# EAGLE design EEZ tester r1B2 (EAGLE 6.1)
Assembly variants: Farnell, TME

## Sheet 1 of 2: Power board tester
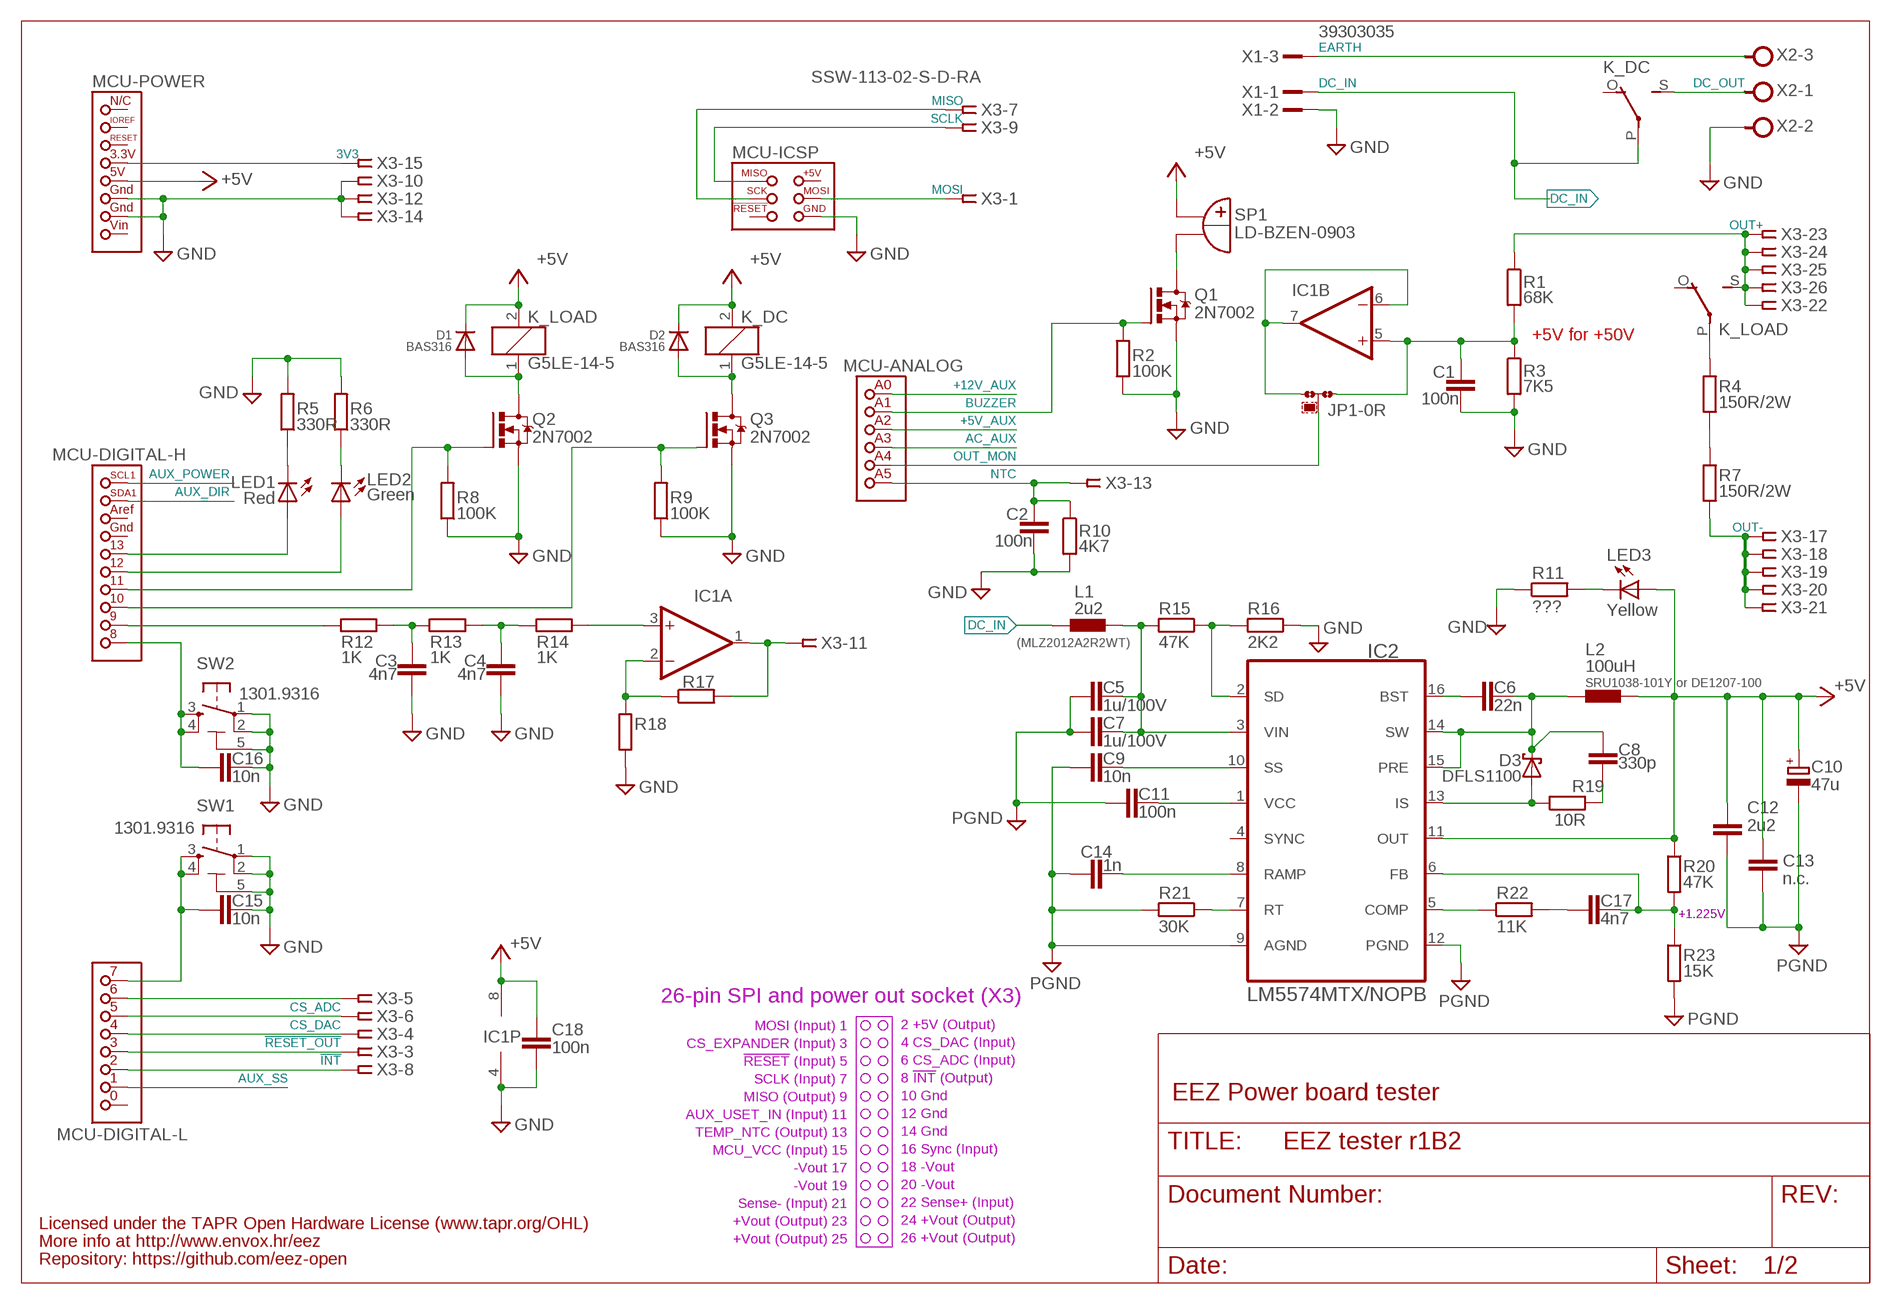
[diagram p0: schematic, sheet 1]

### Parts
C1  100n  C-EUC0603  [C0603]
C2  100n  C-EUC0603  [C0603]
C3  4n7  C-EUC0805  [C0805]
C4  4n7  C-EUC0805  [C0805]
C5  1u/100V  C-EUC1206  [C1206]
C6  22n  C-EUC0805  [C0805]
C7  1u/100V  C-EUC1206  [C1206]
C8  330p  C-EUC0805  [C0805]
C9  10n  C-EUC0805  [C0805]
C10  47u  ECAPPANASONIC_H  [CAPAE660X610N]
C11  100n  C-EUC0603  [C0603]
C12  2u2  C-EUC0805  [C0805]  (variant Farnell: 2320829)  (variant TME: CL21B225KAFNNNG )
C13  n.c.  C-EUC0805  [C0805]  (variant Farnell: 2320829)  (variant TME: CL21B225KAFNNNG )
C14  1n  C-EUC0805  [C0805]
C15  10n  C-EUC0805  [C0805]
C16  10n  C-EUC0805  [C0805]
C17  4n7  C-EUC0805  [C0805]
C18  100n  C-EUC0603  [C0603]
D1  BAS316  DIODE-SOD323-W  [SOD323-W]
D2  BAS316  DIODE-SOD323-W  [SOD323-W]
D3  DFLS1100  SCHOTTKYSOD123  [SOD123]
IC1  TL072SOIC8  [SOIC127P600X173-8N]
IC2  LM5574MTX/NOPB  LM5574  [SOP65P640X110-16N]
JP1  0R-JUMPA  [A0R-JMP]
K_DC  G5LE-14-5  G5LE  [G5LE]
K_LOAD  G5LE-14-5  G5LE  [G5LE]
L1  2u2  L-EU0805  [0805]
L2  100uH  COILCRAFT_MSS1278  [MSS1278]
LED1  Red  LED3MM  [LED3MM]
LED2  Green  LED3MM  [LED3MM]
LED3  Yellow  LED3MM  [LED3MM]
MCU  ARDUINO_LEONARDO  [ARDUINO_LEONARDO]
Q1  2N7002  [SOT103P240X110-3N]
Q2  2N7002  [SOT103P240X110-3N]
Q3  2N7002  [SOT103P240X110-3N]
R1  68K  R-EU_R0805  [R0805]
R2  100K  R-EU_R0805  [R0805]
R3  7K5  R-EU_R0805  [R0805]
R4  150R/2W  R-EU_0617/22  [0617/22]
R5  330R  R-EU_R0805  [R0805]
R6  330R  R-EU_R0805  [R0805]
R7  150R/2W  R-EU_0617/22  [0617/22]
R8  100K  R-EU_R0805  [R0805]
R9  100K  R-EU_R0805  [R0805]
R10  4K7  R-EU_R0805  [R0805]
R11  ???  R-EU_R0805  [R0805]
R12  1K  R-EU_R0805  [R0805]
R13  1K  R-EU_R0805  [R0805]
R14  1K  R-EU_R0805  [R0805]
R15  47K  R-EU_R0805  [R0805]
R16  2K2  R-EU_R0805  [R0805]
R17  R-EU_R0805  [R0805]
R18  R-EU_R0805  [R0805]
R19  10R  R-EU_R1206  [R1206]
R20  47K  R-EU_R0805  [R0805]
R21  30K  R-EU_R0805  [R0805]
R22  11K  R-EU_R0805  [R0805]
R23  15K  R-EU_R0805  [R0805]
SP1  LD-BZEN-0903  BUZZER-2  [LD-BZEN-0903]
SW1  1301.9316  TACT_SW  [TACTM-6XN]
SW2  1301.9316  TACT_SW  [TACTM-6XN]
X1  39303035  MINIFIT-3PIN  [MINIFIT_6659-3]
X2  TBLOCK5.0_3A  [TBLOCK5.0_3]
X3  SSW-113-02-S-D-RA  [TSW-113-02-S-D-RA]

### Nets
3V3: MCU.3.3V(-POWER:3V3) X3.15
!INT: MCU.2(-DIGITAL-L:2(PE4)) X3.8
!RESET_OUT: MCU.3(-DIGITAL-L:3(PE5)) X3.3
+5V: C10.1(+) C12.1 C13.1 C18.1 D1.C D2.C IC1.8(P:V+) IC2.11(OUT) K_DC.2 K_LOAD.2 L2.2 LED3.A MCU.5V(-POWER:5V) R20.1 SP1.+B(+) ; also sheet 2
+5V_AUX: MCU.A2(-ANALOG:ADC2) ; also sheet 2
+12V_AUX: MCU.A0(-ANALOG:ADC0) ; also sheet 2
AC_AUX: MCU.A3(-ANALOG:ADC3) ; also sheet 2
AUX_DIR: MCU.SDA1(-DIGITAL-H:SDA1) ; also sheet 2
AUX_POWER: MCU.SCL1(-DIGITAL-H:SCL1) ; also sheet 2
AUX_SS: MCU.1(-DIGITAL-L:1(PE1)) ; also sheet 2
AUX_USET: IC1.1(A:OUT) R17.2 X3.11
BUZZER: MCU.A1(-ANALOG:ADC1) Q1.1(G) R2.2
CS_ADC: MCU.5(-DIGITAL-L:5(PE3)) X3.6
CS_DAC: MCU.4(-DIGITAL-L:4(PG5)) X3.4
CS_EXPANDER: MCU.6(-DIGITAL-L:6(PH3)) X3.5
DC_IN: K_DC.P(2:P) L1.1 X1.1
DC_OUT: K_DC.S(2:S) X2.1
DC_PREG1: C5.1 C7.1 IC2.3(VIN) L1.2 R15.2
EARTH: X1.3 X2.3
GND [gnd]: C1.1 C2.1 C3.2 C4.2 C5.2 C7.2 C9.2 C10.2(-) C11.1 C12.2 C13.2 C14.1 C15.2 C16.2 C18.2 IC1.4(P:V-) IC2.9(AGND) IC2.12(PGND) MCU.GND1(-POWER:GND1) MCU.GND2(-POWER:GND2) MCU.ICSP_GND(-ICSP:GND) Q1.2(S) Q2.2(S) Q3.2(S) R2.1 R3.2 R5.2 R6.2 R8.1 R9.1 R10.2 R11.1 R16.1 R18.2 R21.2 R23.2 SW1.1 SW1.2 SW1.5(5-GND) SW2.1 SW2.2 SW2.5(5-GND) X1.2 X2.2 X3.10 X3.12 X3.14 ; supply symbol labelled PGND ; also sheet 2
IS: D3.A IC2.13(IS) R19.1
MISO: MCU.ICSP_SCK(-ICSP:SCK) X3.7
MOSI: MCU.ICSP_MOSI(-ICSP:MOSI) X3.1
N$1: R4.1 R7.2
N$2: K_LOAD.P(2:P) R4.2
N$3: LED3.K(C) R11.2
N$5: IC1.6(B:-IN) IC1.7(B:OUT) JP1.3
N$6: MCU.9(-DIGITAL-H:9(PH6)) R12.2
N$7: C1.2 IC1.5(B:+IN) JP1.1 R1.2 R3.1
N$8: MCU.11 Q2.1(G) R8.2
N$9: C4.1 R13.1 R14.2
N$10: Q1.3(D) SP1.-B(-)
N$11: C15.1 MCU.7(-DIGITAL-L:7(PH4)) SW1.3 SW1.4
N$12: LED2.A MCU.12
N$13: C3.1 R12.1 R13.2
N$14: LED1.A MCU.13
N$15: LED1.K(C) R5.1
N$16: LED2.K(C) R6.1
N$17: C16.1 MCU.8(-DIGITAL-H:8(PH5)) SW2.3 SW2.4
N$18: MCU.10 Q3.1(G) R9.2
N$20: D2.A K_DC.1 Q3.3(D)
N$21: D1.A K_LOAD.1 Q2.3(D)
N$46: C8.2 R19.2
N$77: C17.2 R22.2
N$128: C17.1 IC2.6(FB) R20.2 R23.1
N$131: C6.2 IC2.16(BST)
N$135: IC2.5(COMP) R22.1
N$165: IC2.7(RT) R21.1
N$166: C11.2 IC2.1(VCC)
N$167: C14.2 IC2.8(RAMP)
N$168: C9.1 IC2.10(SS)
N$180: IC2.2(SD) R15.1 R16.2
N$223: IC1.2(A:-IN) R17.1 R18.1
N$227: IC1.3(A:+IN) R14.1
NTC: C2.2 MCU.A5(-ANALOG:ADC5) R10.1 X3.13
OUT+: K_LOAD.S(2:S) R1.1 X3.22 X3.23 X3.24 X3.25 X3.26
OUT-: R7.1 X3.17 X3.18 X3.19 X3.20 X3.21
OUT_MON: JP1.2 MCU.A4(-ANALOG:ADC4)
SCLK: MCU.ICSP_MISO(-ICSP:MISO) X3.9
SW1: C6.1 C8.1 D3.C IC2.14(SW) IC2.15(PRE) L2.1
Unconnected: IC2.4(SYNC) K_DC.O(2:O) K_LOAD.O(2:O) MCU.0(-DIGITAL-L:0(PE0)) MCU.AREF(-DIGITAL-H:AREF) MCU.GND(-DIGITAL-H:GND) MCU.ICSP_+5V(-ICSP:+5V) MCU.ICSP_RESET(-ICSP:!RESET) MCU.IOREF(-POWER:IOREF) MCU.N/C(-POWER:N/C) MCU.RESET(-POWER:!RESET) MCU.VIN(-POWER:VIN) X3.2 X3.16

### Notes on the sheet
- +5V for +50V
- (MLZ2012A2R2WT)
- SRU1038-101Y or DE1207-100
- +1.225V
- 26-pin SPI and power out socket (X3)
- MOSI (Input) 1
- 2 +5V (Output)
- CS_EXPANDER (Input) 3
- 4 CS_DAC (Input)
- !RESET! (Input) 5
- 6 CS_ADC (Input)
- SCLK (Input) 7
- 8 !INT! (Output)
- MISO (Output) 9
- 10 Gnd | EEZ Power board tester
- AUX_USET_IN (Input) 11
- 12 Gnd
- TEMP_NTC (Output) 13
- 14 Gnd
- MCU_VCC (Input) 15
- 16 Sync (Input)
- -Vout 17
- 18 -Vout
- -Vout 19
- 20 -Vout
- Sense- (Input) 21
- 22 Sense+ (Input)
- +Vout (Output) 23
- 24 +Vout (Output)
- Licensed under the TAPR Open Hardware License (www.tapr.org/OHL)
- +Vout (Output) 25
- 26 +Vout (Output)
- More info at http://www.envox.hr/eez
- Repository: https://github.com/eez-open

## Sheet 2 of 2: AUX PS tester
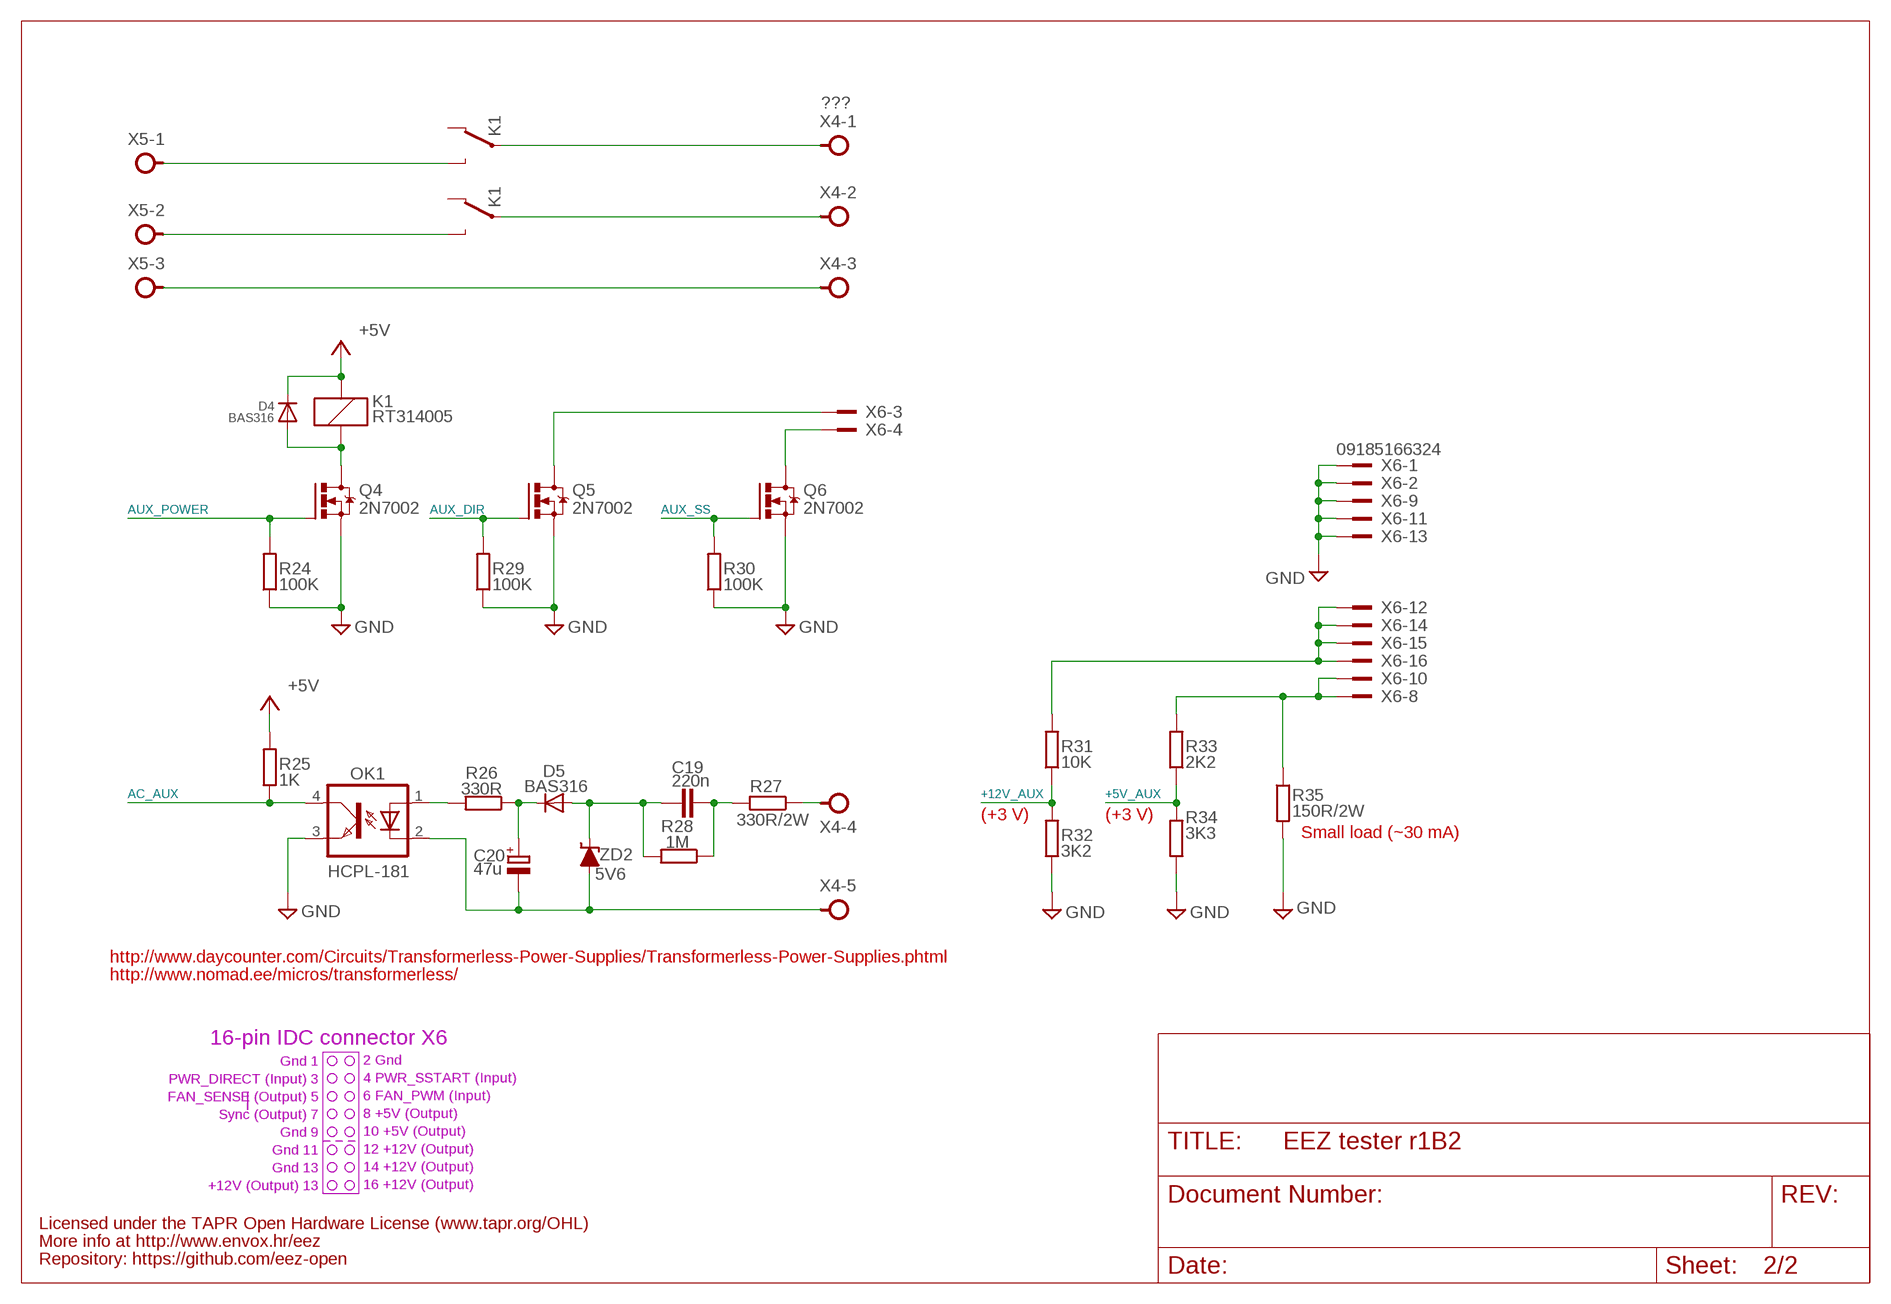
[diagram p1: schematic, sheet 2]

### Parts
C19  220n  C-EU150-084X183  [C150-084X183]
C20  47u  ECAPPANASONIC_H  [CAPAE660X610N]
D4  BAS316  DIODE-SOD323-W  [SOD323-W]
D5  BAS316  DIODE-SOD323-W  [SOD323-W]
K1  RT314005  RELAY_RT314012-2  [RT-C/016A5_ROUND]
OK1  HCPL-181  [HCPL-181]
Q4  2N7002  [SOT103P240X110-3N]
Q5  2N7002  [SOT103P240X110-3N]
Q6  2N7002  [SOT103P240X110-3N]
R24  100K  R-EU_R0805  [R0805]
R25  1K  R-EU_R0805  [R0805]
R26  330R  R-EU_R0805  [R0805]
R27  330R/2W  R-EU_R2512  [R2512]
R28  1M  R-EU_R0805  [R0805]
R29  100K  R-EU_R0805  [R0805]
R30  100K  R-EU_R0805  [R0805]
R31  10K  R-EU_R0805  [R0805]
R32  3K2  R-EU_R0805  [R0805]
R33  2K2  R-EU_R0805  [R0805]
R34  3K3  R-EU_R0805  [R0805]
R35  150R/2W  R-EU_R2512  [R2512]
X4  ???  TBLOCK5.0_5A  [TBLOCK5.0_5]
X5  TBLOCK5.0_3A  [TBLOCK5.0_3]
X6  09185166324  IDC-16PIN  [IDC-16PIN]
ZD2  5V6  ZENER-DIODESOD323  [SOD323-W]

### Nets
+5V: D4.C K1.A2(K:C1) R25.2 ; also sheet 1
+5V_AUX: R33.1 R34.2 ; also sheet 1
+12V_AUX: R31.1 R32.2 ; also sheet 1
AC_AUX: OK1.4(COL) R25.1 ; also sheet 1
AUX_DIR: Q5.1(G) R29.2 ; also sheet 1
AUX_POWER: Q4.1(G) R24.2 ; also sheet 1
AUX_SS: Q6.1(G) R30.2 ; also sheet 1
GND [gnd]: OK1.3(EMIT) Q4.2(S) Q5.2(S) Q6.2(S) R24.1 R29.1 R30.1 R32.1 R34.1 R35.2 X6.1 X6.2 X6.9 X6.11 X6.13 ; also sheet 1
N$4: Q5.3(D) X6.3
N$19: D4.A K1.A1(K:C2) Q4.3(D)
N$22: K1.11B(-2:P) X4.1
N$23: K1.14B(-2:O) X5.1
N$24: K1.14A(-1:O) X5.2
N$25: K1.11A(-1:P) X4.2
N$26: X4.3 X5.3
N$27: R27.1 X4.4
N$28: C19.2 R27.2 R28.1
N$29: C19.1 D5.A R28.2 ZD2.C
N$31: C20.2(-) OK1.2(C) X4.5 ZD2.A
N$32: Q6.3(D) X6.4
N$33: OK1.1(A) R26.2
N$34: C20.1(+) D5.C R26.1
N$37: R33.2 R35.1 X6.8 X6.10
N$38: R31.2 X6.12 X6.14 X6.15 X6.16
Unconnected: K1.12A(-1:S) K1.12B(-2:S) X6.5 X6.6 X6.7

### Notes on the sheet
- (+3 V) | (+3 V)
- Small load (~30 mA)
- http://www.daycounter.com/Circuits/Transformerless-Power-Supplies/Transformerless-Power-Supplies.phtml
- http://www.nomad.ee/micros/transformerless/
- 16-pin IDC connector X6
- Gnd 1
- 2 Gnd
- PWR_DIRECT (Input) 3
- 4 PWR_SSTART (Input)
- FAN_SENSE (Output) 5
- 6 FAN_PWM (Input)
- Sync (Output) 7
- 8 +5V (Output)
- Gnd 9
- 10 +5V (Output)
- Gnd 11
- 12 +12V (Output)
- Gnd 13
- 14 +12V (Output)
- +12V (Output) 13
- 16 +12V (Output)
- Licensed under the TAPR Open Hardware License (www.tapr.org/OHL)
- More info at http://www.envox.hr/eez
- Repository: https://github.com/eez-open

## Library data of the parts
C1-C9 C11-C19 = rcl:C-EU: CAPACITOR, European symbol
C10 C20 = EEZ_Lib1:ECAP
D1 D2 D4 D5 = diode:DIODE-: DIODE
D3 = EEZ_Lib1:SCHOTTKY
IC1 = EEZ_Lib1:TL072
IC2 = EEZ_Lib1:LM5574: Step-Down Switching Regulator; MPN: LM5574MT; OC_FARNELL: 1325419; OC_NEWARK: 32M1267; PACKAGE: TSSOP-16; SUPPLIER: National Semiconductors
JP1 = jump-0r-smd:0R-JUMP: SMD 0R 0805 Jumper
K1 = EEZ_Lib1:RELAY_RT314012
K_DC K_LOAD = relay:G5LE: RELAY 1 x switch, 10 A/120 V AC, 8 A/30 V DC, Omron; OC_FARNELL: unknown; OC_NEWARK: unknown
L1 = EEZ_Lib1:L-EU
L2 = EEZ_Lib1:COILCRAFT_MSS1278: Coilcraft SMT Power Inductors – MSS1278
LED1-LED3 = led:LED: LED OSRAM: - CHIPLED LG R971, LG N971, LY N971, LG Q971, LY Q971, LO R971, LY R971 LH N974, LH R974 LS Q976, LO Q976, LY Q976 LO Q996 - Hyper CHIPLED LW Q18S LB Q993, LB Q99A, LB R99A - SideLED LS A670, LO A670, LY A670, LG A670, LP A670 LB A673, LV A673, LT A673, LW A673 LH A674 LY A675 LS A676, LA A676, LO A676, LY A676, LW A676 LS A679, LY A679, LG A679 - Hyper Micro SIDELED® LS Y876, LA Y876, LO Y876, LY Y876 LT Y87S - SmartLED LW L88C, LW L88S LB L89C, LB L89S, LG L890 LS L89K, LO L89K, LY L89K LS L896, LA L896, LO L896, LY L896 - TOPLED LS T670, LO T670, LY T670, LG T670, LP T670 LSG T670, LSP T670, LSY T670, LOP T670, LYG T670 LG T671, LOG T671, LSG T671 LB T673, LV T673, LT T673, LW T673 LH T674 LS T676, LA T676, LO T676, LY T676, LB T676, LH T676, LSB T676, LW T676 LB T67C, LV T67C, LT T67C, LS T67K, LO T67K, LY T67K, LW E67C LS E67B, LA E67B, LO E67B, LY E67B, LB E67C, LV E67C, LT E67C LW T67C LS T679, LY T679, LG T679 LS T770, LO T770, LY T770, LG T770, LP T770 LB T773, LV T773, LT T773, LW T773 LH T774 LS E675, LA E675, LY E675, LS T675 LS T776, LA T776, LO T776, LY T776, LB T776 LHGB T686 LT T68C, LB T68C - Hyper Mini TOPLED® LB M676 - Mini TOPLED Santana® LG M470 LS M47K, LO M47K, LY M47K Source: http://www.osram.convergy.de LUXEON: - LUMILED® LXK2-PW12-R00, LXK2-PW12-S00, LXK2-PW14-U00, LXK2-PW14-V00 LXK2-PM12-R00, LXK2-PM12-S00, LXK2-PM14-U00 LXK2-PE12-Q00, LXK2-PE12-R00, LXK2-PE12-S00, LXK2-PE14-T00, LXK2-PE14-U00 LXK2-PB12-K00, LXK2-PB12-L00, LXK2-PB12-M00, LXK2-PB14-N00, LXK2-PB14-P00, LXK2-PB14-Q00 LXK2-PR12-L00, LXK2-PR12-M00, LXK2-PR14-Q00, LXK2-PR14-R00 LXK2-PD12-Q00, LXK2-PD12-R00, LXK2-PD12-S00 LXK2-PH12-R00, LXK2-PH12-S00 LXK2-PL12-P00, LXK2-PL12-Q00, LXK2-PL12-R00 Source: www.luxeon.com KINGBRIGHT: KA-3528ASYC Source: www.kingbright.com
MCU = EEZ_Lib1:ARDUINO_LEONARDO
OK1 = EEZ_Lib1:HCPL-181: Phototransistor Optocoupler SMD Mini-Flat Type
Q1-Q6 = MyLib6:2N7002: N-CHANNEL ENHANCEMENT MODE FIELD EFFECT TRANSISTOR; MPN: 2N7002-7-F; OC_FARNELL: 1713823; OC_NEWARK: 25R5679; PACKAGE: SOT-23-3; SUPPLIER: DIODES INC.
R1-R35 = rcl:R-EU_: RESISTOR, European symbol
SP1 = EEZ_Lib1:BUZZER: Loudity LD-BZEN-0903 Sound transducer: electromagnetic; without built-in generator; TME: LD-BZEN-0903
SW1 SW2 = EEZ_Lib1:TACT_SW
X1 = EEZ_Lib1:MINIFIT-3PIN: MOLEX 39303035 Wire-To-Board Connector, Single In Line, Mini-Fit Jr 5569 Series, 3 Contacts, Plug, 4.2 mm; FARNELL: 9963545
X2 X5 = EEZ_Lib1:TBLOCK5.0_3A
X3 = con-samtec:SSW-113-02-S-D: THROUGH-HOLE .025" SQ POST SOCKET Source: Samtec SSW.pdf; MPN: SSW-113-02-S-D-RA; OC_FARNELL: unknown; OC_NEWARK: 11P9531
X4 = EEZ_Lib1:TBLOCK5.0_5A
X6 = EEZ_Lib1:IDC-16PIN
ZD2 = EEZ_Lib1:ZENER-DIODE

## Net classes
0 default: width 0.254 mm, drill 0.584 mm, clearance 0.254 mm
1 dgnd: width 0.254 mm, drill 0.584 mm, clearance 0.254 mm
2 gnd: width 0.254 mm, drill 0.584 mm, clearance 0.254 mm

## Board
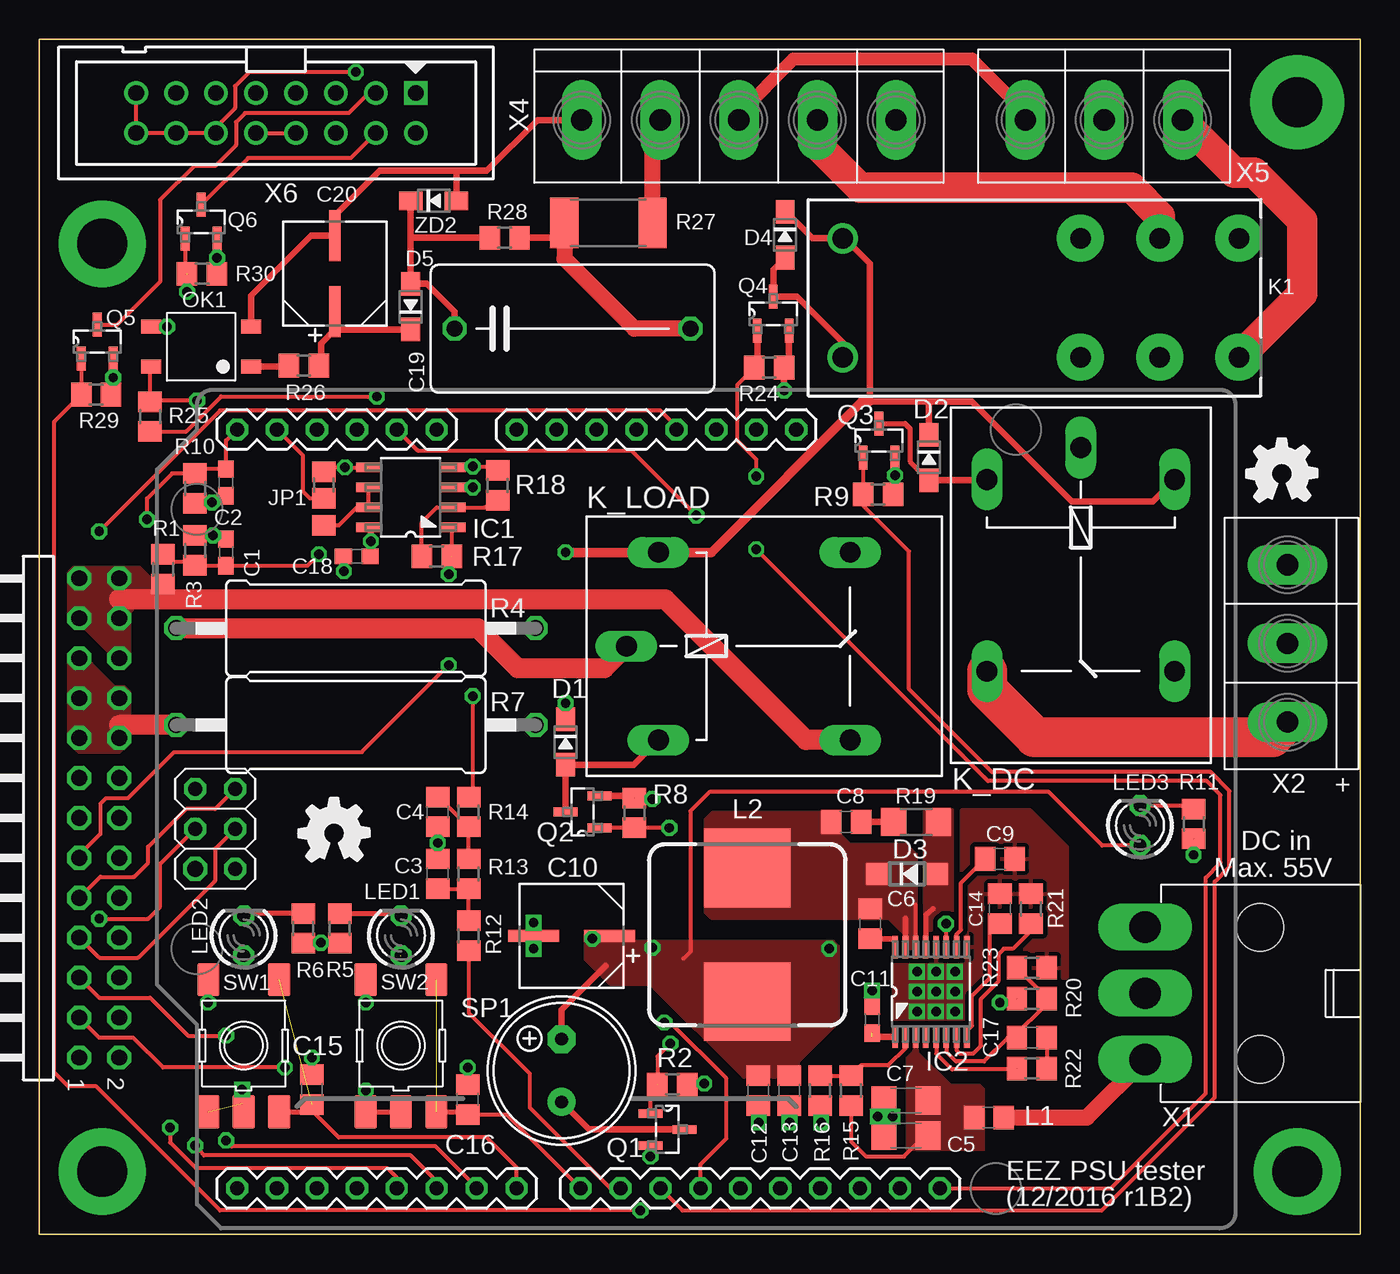
[diagram p2: board, top side]
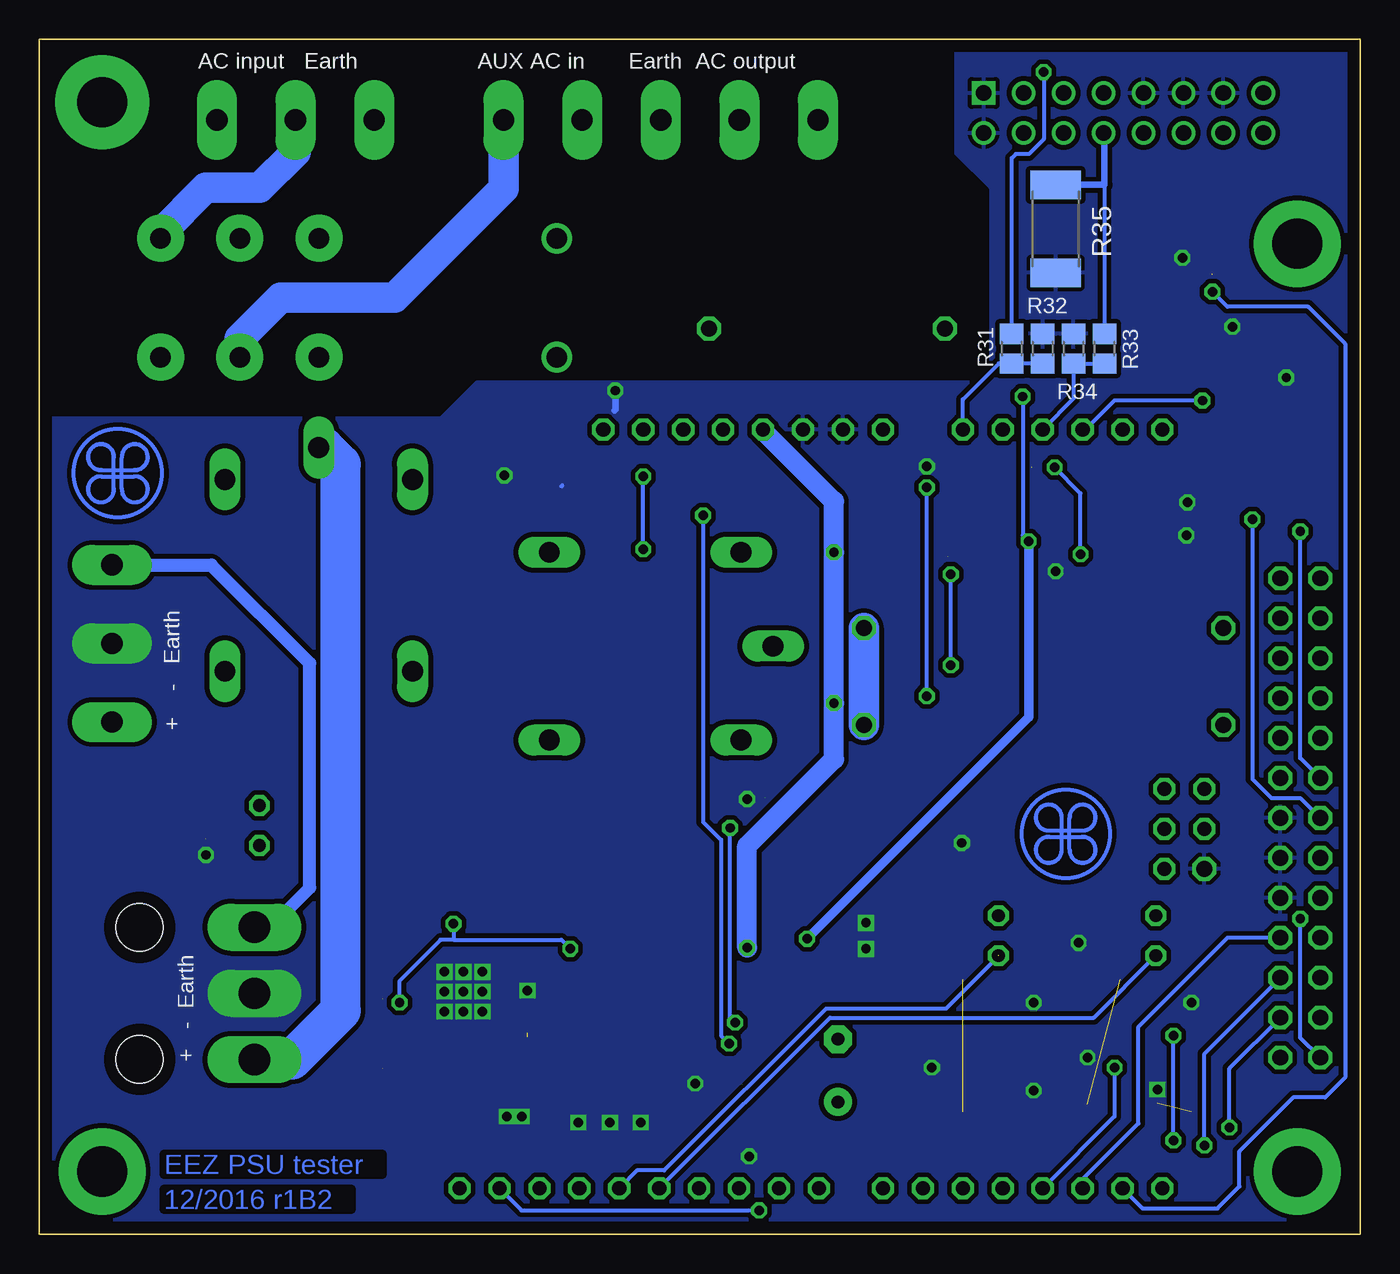
[diagram p3: board, bottom side, seen from below]

Size 84 x 76 mm. Coordinates in mm from the lower left corner, seen from the top.
Outline: 0,0 84,0 84,76 0,76 0,0
Copper layers (1*16): Top 0.035mm / dielectric 1.5mm / Bottom 0.035mm
Design rules: minimum track width 10mil, minimum drill 0.5mm, track to track 8mil, track to pad 8mil, pad to pad 8mil, via to via 8mil, smd to smd 8mil, copper to edge 30mil, drill to drill 8mil, minimum pad ring 10mil, minimum via ring 8mil, stop-mask expansion 4mil, vias tented up to drill 25mil, thermal gap 10mil

### Footprints (pad centres in the part's own frame; a part is rotated, then mirrored left to right if it is on the bottom)
C0603 = smd 1.1 x 1: 1 -0.85,0; 2 0.85,0
C0805 = smd 1.3 x 1.5: 1 -0.95,0; 2 0.95,0
C1206 = smd 1.6 x 1.8: 1 -1.4,0; 2 1.4,0
CAPAE660X610N = smd 3.251 x 0.762: 1 -2.413,0; 2 2.413,0
C150-084X183 = drill 1.016 octagon: 1 -7.493,0; 2 7.493,0
SOD323-W = smd 1.5 x 1.2: A 1.45,0; C -1.45,0
SOD123 = smd 1.4 x 1.4: A 1.9,0; C -1.9,0
SOIC127P600X173-8N = smd 1.55 x 0.6: 1 -2.7,1.9; 2 -2.7,0.63; 3 -2.7,-0.64; 4 -2.7,-1.91; 5 2.7,-1.91; 6 2.7,-0.64; 7 2.7,0.63; 8 2.7,1.9
SOP65P640X110-16N = smd 1.422 x 0.356: 1 -2.845,2.286; 2 -2.845,1.626; 3 -2.845,0.965; 4 -2.845,0.33; 5 -2.845,-0.33; 6 -2.845,-0.965; 7 -2.845,-1.626; 8 -2.845,-2.286; 9 2.845,-2.286; 10 2.845,-1.626; 11 2.845,-0.965; 12 2.845,-0.33; 13 2.845,0.33; 14 2.845,0.965; 15 2.845,1.626; 16 2.845,2.286
A0R-JMP = smd 1.5 x 1.3: 1 0,1.7; 2 0,0; 3 0,-1.7
RT-C/016A5_ROUND = drill 1.3 pad 3: 11A 8.83,3.78; 11B 8.83,-3.78; 12A 3.79,3.78; 12B 3.79,-3.78; 14A 13.87,3.78; 14B 13.87,-3.78 | drill 1.3: A1 -11.33,-3.78; A2 -11.33,3.78
G5LE = drill 1.321 long: 1 -7.493,-5.969; 2 -7.493,5.969; O 4.699,5.969; P -9.525,0; S 4.699,-5.969
0805 = smd 1.3 x 1.5: 1 -0.95,0; 2 0.95,0
MSS1278 = smd 5.5 x 5: 1 0,4.25; 2 0,-4.25
LED3MM = drill 0.813 octagon: A -1.27,0; K 1.27,0
ARDUINO_LEONARDO = drill 0.9 octagon: 0 63.5,50.8; 1 60.96,50.8; 2 58.42,50.8; 3 55.88,50.8; 3.3V 35.56,2.54; 4 53.34,50.8; 5 50.8,50.8; 5V 38.1,2.54; 6 48.26,50.8; 7 45.72,50.8; 8 41.656,50.8; 9 39.116,50.8; 10 36.576,50.8; 11 34.036,50.8; 12 31.496,50.8; 13 28.956,50.8; A0 50.8,2.54; A1 53.34,2.54; A2 55.88,2.54; A3 58.42,2.54; A4 60.96,2.54; A5 63.5,2.54; AREF 23.876,50.8; GND 26.416,50.8; GND1 40.64,2.54; GND2 43.18,2.54; ICSP_+5V 66.167,25.4; ICSP_MISO 63.627,25.4; ICSP_MOSI 66.167,27.94; ICSP_RESET 63.627,30.48; ICSP_SCK 63.627,27.94; IOREF 30.48,2.54; N/C 27.94,2.54; RESET 33.02,2.54; SCL1 18.796,50.8; SDA1 21.336,50.8; VIN 45.72,2.54 | drill 1.016 octagon: ICSP_GND 66.167,30.48
HCPL-181 = smd 0.889 x 1.27: 1 -1.27,-3.175; 2 1.27,-3.175; 3 1.27,3.175; 4 -1.27,3.175
SOT103P240X110-3N = smd 1.524 x 0.559: 1 -1.079,1.016; 2 -1.079,-1.016; 3 1.079,0
R0805 = smd 1.3 x 1.5: 1 -0.95,0; 2 0.95,0
0617/22 = drill 1.016 octagon: 1 -11.43,0; 2 11.43,0
R1206 = smd 1.6 x 1.803: 1 -1.422,0; 2 1.422,0
R2512 = smd 1.8 x 3.2: 1 -2.8,0; 2 2.8,0
LD-BZEN-0903 = drill 0.8 pad 1.778 octagon: +B 2,0 | drill 0.8 pad 1.778: -B -2,0
TACTM-6XN = smd 2.1 x 1.4: 1 -4.2,2.25; 2 4.2,2.25; 3 -4.2,-2.25; 4 4.2,-2.25; 5 -4.2,0
MINIFIT_6659-3 = drill 2 pad 2.54 long: 1 0,0; 2 0,-4.2; 3 0,-8.4 | hole 3: -7.3,0; -7.3,-8.4
TBLOCK5.0_3 = drill 1.35 pad 2.54 long: 1 0,0; 2 0,-5; 3 0,-10
TSW-113-02-S-D-RA = drill 1 pad 1.5 octagon: 1 15.24,1.524; 2 15.24,4.064; 3 12.7,1.524; 4 12.7,4.064; 5 10.16,1.524; 6 10.16,4.064; 7 7.62,1.524; 8 7.62,4.064; 9 5.08,1.524; 10 5.08,4.064; 11 2.54,1.524; 12 2.54,4.064; 13 0,1.524; 14 0,4.064; 15 -2.54,1.524; 16 -2.54,4.064; 17 -5.08,1.524; 18 -5.08,4.064; 19 -7.62,1.524; 20 -7.62,4.064; 21 -10.16,1.524; 22 -10.16,4.064; 23 -12.7,1.524; 24 -12.7,4.064; 25 -15.24,1.524; 26 -15.24,4.064
TBLOCK5.0_5 = drill 1.35 pad 2.54 long: 1 0,0; 2 0,-5; 3 0,-10; 4 0,-15; 5 0,-20
IDC-16PIN = drill 1 pad 1.422 square: 1 -8.89,-1.27 | drill 1 pad 1.422: 2 -8.89,1.27; 3 -6.35,-1.27; 4 -6.35,1.27; 5 -3.81,-1.27; 6 -3.81,1.27; 7 -1.27,-1.27; 8 -1.27,1.27; 9 1.27,-1.27; 10 1.27,1.27; 11 3.81,-1.27; 12 3.81,1.27; 13 6.35,-1.27; 14 6.35,1.27; 15 8.89,-1.27; 16 8.89,1.27

### Placement (x,y rotation side)
C1  11.87,43.37 270 top
C2  11.87,47.82 90 top
C3  25.34,22.93 90 top
C4  25.34,26.86 270 top
C5  55.12,6.29 180 top
C6  52.83,19.75 270 top
C7  55.12,8.51 180 top
C8  51.31,26.23 0 top
C9  61.09,23.88 0 top
C10  33.85,18.99 180 top
C11  52.96,13.65 270 top
C12  45.72,9.15 270 top
C13  47.69,9.15 270 top
C14  61.09,20.7 270 top
C15  17.34,9.21 90 top
C16  27.24,8.57 90 top
C17  63.12,12.51 0 top
C18  20.19,43.12 180 top
C19  33.91,57.6 0 top
C20  18.8,61.09 90 top
D1  33.46,31.31 270 top
D2  56.58,49.41 270 top
D3  55.18,22.93 0 top
D4  47.43,63.57 270 top
D5  23.62,58.99 90 top
EEZ_SIGNATURE  SIGNATURESMALL  [SIGNATURE_5MM]  18.73,25.48 180 top
EEZ_SIGNATURE2  SIGNATURESMALL  [SIGNATURE_5MM]  79,48.41 180 top
IC1  23.62,46.87 180 top
IC2  56.71,15.43 90 top
JP1  18.1,46.8 0 top
K1  62.42,59.56 0 top
K_DC  66.23,40.52 270 top
K_LOAD  46.86,37.4 0 top
L1  60.39,7.43 180 top
L2  45.02,19.05 0 top
LED1  23,19 90 top
LED2  13,19 90 top
LED3  70,26 90 top
MCU  76.07,53.72 180 top
OK1  10.29,56.45 90 top
Q1  39.94,6.67 0 top
Q2  34.54,26.86 180 top
Q3  53.4,50.48 90 top
Q4  46.67,58.55 90 top
Q5  3.68,56.77 90 top
Q6  10.29,64.39 90 top
R1  7.87,42.29 90 top
R2  40.26,9.53 180 top
R3  9.91,43.5 90 top
R4  20.13,38.55 180 top
R5  19.11,19.46 270 top
R6  16.78,19.46 270 top
R7  20.13,32.39 0 top
R8  37.85,26.8 270 top
R9  53.34,47.06 180 top
R10  9.91,47.44 270 top
R11  73.41,26.1 90 top
R12  27.3,18.99 270 top
R13  27.3,22.93 270 top
R14  27.3,26.86 270 top
R15  51.63,9.15 270 top
R16  49.66,9.15 90 top
R17  25.27,43.12 0 top
R18  29.15,47.63 90 top
R19  55.75,26.23 180 top
R20  63.12,14.99 0 top
R21  63.06,20.7 90 top
R22  63.12,10.54 0 top
R23  63.12,16.96 0 top
R24  46.42,55.12 180 top
R25  7.05,52.01 270 top
R26  16.83,55.25 180 top
R27  36.2,64.33 180 top
R28  29.59,63.38 180 top
R29  3.62,53.41 180 top
R30  10.35,61.09 180 top
R31  22.16,56.33 90 bottom
R32  20.19,56.33 270 bottom
R33  16.26,56.33 90 bottom
R34  18.22,56.33 270 bottom
R35  19.37,63.95 270 bottom
SP1  33.21,10.42 90 top
SW1  13,12 90 top
SW2  23,12 90 top
X1  70.33,11.13 180 top
X2  79.38,32.58 180 top
X3  1.02,26.48 270 top
X4  54.48,70.87 270 top
X5  72.71,70.87 270 top
X6  15.05,71.31 180 top
ZD2  25.08,65.72 0 top

### Tracks (layer width: path | path; a pad name or v marks a point on that pad's centre or on a via)
3V3  (via drill 0.6)
  Top 0.254: MCU.3.3V 40.51,51.37 39.5,52.39 11.49,52.39 v3.81,44.71
  Bottom 0.254: X3.15 3.81,30.29 v3.81,44.71
!INT
  Bottom 0.254: MCU.2 17.65,3.49 14.1,7.05 14.1,13.21 8.45,18.86 X3.8
!RESET_OUT  (via drill 0.6)
  Top 0.254: X3.3 3.81,12.51 5.97,12.51 7.87,10.61 v15.62,10.61
  Bottom 0.254: v15.62,10.61 15.62,7.5 MCU.3
+5V  (via drill 0.6)  (1 unrouted)
  Top 0.254: IC2.11 57.67,19.74 v57.66,19.75 | D1.C v33.47,33.78 | v61.09,14.73 62.17,14.73 R20.1 | LED3.A 67.6,24.73 64.2,28.13 42.61,28.13 41.4,26.93 41.4,17.97 40.96,17.53 | R25.2 9.34,51.06 11.56,53.28 v21.46,53.28
  Top 0.406: 56.45,52.96 52.77,52.96 52.83,53.03 52.83,61.72 51.21,63.34 K1.A2 49.18,63.34 47.51,65.02 D4.C | D2.C 56.58,52.83 56.45,52.96 | C18.1 21.08,43.16 v21.08,44.07 21.08,44.8 IC1.8 | SP1.+B 33.21,14.29 36.01,17.08 | 56.45,52.96 59.31,52.96 65.66,46.61 70.8,46.61 K_DC.2
  Top 0.61: 52.77,52.96 52.32,52.96 42.74,43.37 K_LOAD.2 v33.47,43.37
  Bottom 0.254: v57.66,19.75 57.66,18.73 | 57.66,18.73 58.48,18.73 61.09,16.13 v61.09,14.73 | 57.66,18.73 50.8,18.73 v50.23,18.16 | v21.46,53.28 21.46,44.45 v21.08,44.07
  Bottom 0.61: v21.08,44.07 21.08,32.9 v35.18,18.8
  Bottom 1.27: v38.99,18.23 38.99,24.7 33.47,30.23 v33.47,33.78 v33.47,43.37 33.47,46.61 37.97,51.12 MCU.5V
  pour Top (isolate 0.305, no thermals): 48.26,10.04 48.26,10.99 50.8,13.53 50.8,18.29 50.48,18.61 34.73,18.61 34.73,17.53 36.32,15.94 38.86,15.94 44.77,10.04 44.77,10.04
+5V_AUX
  Bottom 0.254: R33.1 R34.2 18.22,53.15 MCU.A2
+12V_AUX
  Bottom 0.254: R32.2 R31.1 22.98,55.38 25.27,53.09 MCU.A0
AC_AUX  (via drill 0.6)
  Top 0.254: v10.03,53.03 7.11,53.03 R25.1 7.05,55.12 OK1.4
  Bottom 0.254: MCU.A3 17.46,51.18 15.62,53.03 v10.03,53.03
AUX_DIR  (via drill 0.6)
  Top 0.254: Q5.1 R29.2 0.95,51.69 0.95,10.29 1.84,9.4 3.62,9.4 11.49,1.53 v38.23,1.53
  Bottom 0.254: MCU.SDA1 53.34,1.53 v38.23,1.53
AUX_POWER  (via drill 0.6)
  Top 0.254: MCU.SCL1 68.14,2.92 74.17,8.96 74.17,22.67 75.12,23.62 75.12,27.94 74.23,28.83 60.33,28.83 v45.59,43.56 | v45.59,48.2 45.59,49.28 44.39,50.48 44.39,54.04 R24.2
  Top 0.406: Q4.1 45.66,55.31 R24.2
  Bottom 0.254: v45.59,43.56 v45.59,48.2
AUX_SS  (via drill 0.6)  (1 unrouted)
  Top 0.254: Q6.1 9.27,61.22 R30.2 | v9.4,59.95 9.4,61.03
  Bottom 0.254: v9.4,59.95 8.45,58.99 3.3,58.99 0.95,56.64 0.95,9.97 2.22,8.7 4.25,8.7 7.68,5.27 7.68,3.05 9.08,1.65 13.84,1.65 MCU.1
AUX_USET  (via drill 0.6)  (1 unrouted)
  Top 0.254: IC1.1 26.23,44.87 R17.2 | v26.04,41.98 26.04,42.93 R17.2 | v26.04,36.2 20.51,30.67 8.57,30.67 5.65,27.75 4.25,27.75 3.87,27.37 3.87,25.47 2.54,24.13 X3.11
  Bottom 0.254: v26.04,36.2 v26.04,41.98
BUZZER  (via drill 0.6)  (1 unrouted)
  Top 0.254: Q1.1 38.86,9.08 R2.2 | v40.13,12.13 39.31,11.3 R2.2 | MCU.A1 24.07,49.85 37.66,49.85 v41.78,45.72
  Bottom 0.254: v41.78,45.72 41.78,26.23 40.64,25.08 40.64,12.64 v40.13,12.13
CS_ADC  (via drill 0.6)
  Top 0.254: MCU.5 25.27,3.37 23.62,5.02 10.48,5.02 v9.91,5.65
  Bottom 0.254: v9.91,5.65 9.91,11.5 X3.6
CS_DAC  (via drill 0.6)
  Top 0.254: MCU.4 22.73,3.62 22.16,4.19 9.97,4.19 8.32,5.84 v8.32,6.8
  Bottom 0.254: v8.32,6.8 8.32,10.54 X3.4
CS_EXPANDER  (via drill 0.6)
  Top 0.254: X3.5 3.81,15.05 7.05,15.05 9.46,12.64 v11.87,12.64 | MCU.6 27.81,2.99 25.21,5.59 12.26,5.59 v11.87,5.97
  Bottom 0.254: v11.87,5.97 v11.87,12.64
DC_IN
  Top 1.016: L1.1 66.63,7.43 X1.1
  Bottom 1.27: 65.91,50.04 K_DC.P
  Bottom 2.54: 65.91,50.04 64.83,48.96 64.83,14.23 67.93,11.13 X1.1
DC_OUT
  Top 2.54: K_DC.S 60.26,34.67 63.31,31.62 78.42,31.62 X2.1
DC_PREG1
  Top 0.254: R15.2 51.63,5.91 52.58,4.95 54.99,4.95 56.33,6.29 C5.1 | 56.52,7.75 C7.1
  pour Top (isolate 0.305, no thermals): 55.82,12.57 55.82,11.56 57.91,9.46 59.75,9.46 60.01,9.21 60.01,5.4 55.24,5.4 55.24,11.56 55.63,11.56 55.63,12.57
EARTH
  Bottom 0.813: X1.3 69.31,19.53 66.8,22.04 66.8,36.32 73.06,42.58 X2.3
GND  (via drill 0.6)  (3 unrouted)
  Top 0.254: IC2.9 59,18.28 | R16.1 49.66,7.18 v49.72,7.11 | C13.2 47.69,7.22 v47.71,7.11 | C12.2 45.72,7.28 v45.74,7.11 | C5.2 53.31,6.69 v53.31,7.5 53.31,8.11 C7.2 | Q3.2 v54.42,48.26 54.42,47.19 R9.1 | R10.2 10.93,46.49 v10.99,46.55 11.4,46.97 C2.1 | R3.2 v11.05,44.45 11.64,44.45 C1.1 | IC1.4 27.5,48.78 v27.56,48.83 28.64,48.83 R18.2 | C18.2 19.34,42.19 v19.37,42.17 | C3.2 v25.34,24.89 C4.2 | v31.43,18.16 C10.2 | R2.1 42.23,9.53 v42.29,9.59 | v38.86,4.95 Q1.2 | v20.77,9.15 20.77,7.81 SW2.1 | v12.89,9.21 12.89,8.32 SW1.5 | v73.41,24.13 R11.1 | 4.7,55.63 v4.7,54.48 4.7,53.53 R29.1 | 4.7,55.63 4.76,55.69 | v8.13,57.72 OK1.3 | 4.7,55.63 Q5.2 | R30.1 v11.3,62.11 Q6.2
  Top 0.305: C11.1 v52.96,15.5 | R5.2 19.07,18.54 v17.91,18.54 16.82,18.54 R6.2 | v10.73,14.73 10.73,16.18 SW1.2 | v20.77,14.73 20.77,16.19 SW2.2 | v17.34,11.24 C15.2 | v27.24,10.61 C16.2 | SW2.1 SW2.5
  Top 0.406: Q2.2 37.72,27.88 R8.1 | R8.1 38.93,27.75 v38.99,27.69 | Q4.2 47.69,55.44 R24.1 47.37,53.98 v47.37,53.66
  Bottom 0.254: 50.8,47.56 50.74,47.63
  Bottom 0.406: v47.37,53.66 47.37,52.45 47.43,52.39
  other vias: 55.82,15.43 57.02,16.7 57.02,15.43 57.02,14.16 58.23,15.43 55.82,14.16 55.82,16.7 58.23,14.16 58.23,16.7 54.27,7.5 31.43,19.81
  pour Top (isolate 0.305): 54.36,13.15 54.36,17.59 58.67,17.59 58.67,26.99 62.99,26.99 65.34,24.64 65.34,16.32 63.18,16.32 61.02,17.4 61.02,13.15
  pour Bottom (isolate 0.305, rank 2): 0.32,75.76 25.4,75.76 25.72,75.44 25.72,68.77 23.5,66.55 23.5,54.17 56.2,54.17 58.48,51.88 83.95,51.88 83.95,0.13 0.32,0.13
  pour Bottom (no thermals): 76.2,39.24 82.55,39.24 82.55,36.07 82.55,35.75 76.2,35.75
  pour Bottom (isolate 0.305, no thermals): 67.18,17.08 73.53,17.08 73.53,13.59 67.18,13.59
HOLE_DL  (via drill 3.2 pad 5.5)
  other vias: 4,63
HOLE_DR  (via drill 3.2 pad 5.5)
  other vias: 4,4
HOLE_UL  (via drill 3.2 pad 5.5)
  other vias: 80,4
IS
  Top 0.356: IC2.13 56.38,20.31 56.83,20.7
  pour Top (isolate 0.305, rank 2, no thermals): 56.32,19.37 56.32,26.99 58.04,26.99 58.04,19.37
MISO
  Top 0.254: MCU.ICSP_SCK 11.18,24.51 11.18,22.48 6.29,17.59 3.81,17.59 X3.7
MOSI  (via drill 0.6)
  Top 0.254: v3.81,20.07 6.92,20.07 7.68,20.83 7.68,23.56 MCU.ICSP_MOSI
  Bottom 0.254: X3.1 3.81,12.51 v3.81,20.07
N$1
  Bottom 1.93: R4.1 R7.2
N$2
  Top 1.27: R4.2 27.88,38.55 30.42,36.01 35.94,36.01 K_LOAD.P
N$3
  Top 0.254: LED3.K 73.19,27.27 R11.2
N$4
  Top 0.254: Q5.3 4.95,57.85 7.68,60.58 7.68,65.79 9.84,67.95 11.18,67.95 12.51,69.28 12.51,70.74 13.08,71.31 19.68,71.31 20.95,72.58 X6.3
N$5
  Top 0.254: IC1.6 IC1.7 20.19,46.23 19.06,45.1 JP1.3
N$6
  Top 0.254: R12.2 27.3,14.1 31.18,10.23 31.18,8.07 36.32,2.92 MCU.9
N$7  (via drill 0.6)  (1 unrouted)
  Top 0.254: R1.2 7.87,43.18 8.26,42.8 9.65,42.8 R3.1 11.85,42.55 C1.2 17.06,42.52 v17.78,43.24 | 20.89,48.77 20.89,48.78 v19.43,48.78 18.37,48.78 JP1.1
  Bottom 0.254: v17.78,43.24 17.78,47.12 v19.43,48.78
N$8  (via drill 0.6)
  Top 0.254: MCU.11 42.04,4.45 43.69,6.1 43.69,9.91 40.13,13.46 v39.75,13.46 | Q2.1 R8.2 v40.07,25.85
  Bottom 0.254: v39.75,13.46 40.07,13.78 v40.07,25.85
N$9
  Top 0.254: R13.1 R14.2 25.4,27.81 C4.1
N$10
  Top 0.406: Q1.3 34.96,6.67 SP1.-B
N$11  (1 unrouted)
  Top 0.254: MCU.7 30.35,4.26 28.45,6.16 19.05,6.16 17.41,7.8 17.16,7.8
  Top 0.305: SW1.3 17.16,7.8 C15.1
N$12
  Bottom 0.254: MCU.12 33.72,13.78 16.95,13.78 LED2.A
N$13
  Top 0.254: R12.1 R13.2 C3.1
N$14  (1 unrouted)
  Bottom 0.254: 22.99,17.72 26.35,14.35 33.97,14.35 44.26,4.07 45.97,4.07 MCU.13
N$15
  Top 0.305: R5.1 22.86,20.41 LED1.K
N$16
  Top 0.305: R6.1 13.14,20.41 LED2.K
N$17  (1 unrouted)
  Top 0.254: C16.1 29.71,7.62 MCU.8
  Top 0.305: SW2.3 27.07,7.8 C16.1
N$18
  Top 0.254: MCU.10 40.89,1.53 67.56,1.53 74.74,8.7 74.74,22.42 75.69,23.37 75.69,28.2 74.49,29.4 60.58,29.4 55.31,34.67 55.31,43.44 52.39,46.35 R9.2 Q3.1
N$19
  Top 0.406: K1.A1 51.09,56.73 48.2,59.63 Q4.3 46.67,61.35 D4.A
N$20
  Top 0.305: Q3.3 55.05,51.56 55.37,51.25 55.37,49.16 D2.A
  Top 0.406: D2.A 60.21,47.95 K_DC.1
N$21
  Top 0.406: K_LOAD.1 37.79,29.86 D1.A Q2.3
N$22
  Bottom 1.93: K1.11B 71.25,56.96 68.64,59.56 61.4,59.56 54.9,66.07 54.55,66.42 54.48,66.49 X4.1
N$23
  Top 1.93: X5.1 72.71,70.81 76.01,67.5 77.28,67.5 80.33,64.45 80.33,59.82 K1.14B
N$24
  Bottom 1.93: K1.14A 76.29,63.67 73.41,66.55 69.98,66.55 67.71,68.82 X5.2
N$25
  Top 1.93: K1.11A 71.25,64.77 69.47,66.55 52.2,66.55 49.48,69.26 X4.2
N$26
  Top 0.813: 62.71,71.34 59.31,74.74 47.94,74.74 44.48,71.28
  Top 1.016: X5.3 62.71,71.34 | X4.3 44.48,71.28
N$27
  Top 1.016: R27.1 38.99,70.38 X4.4
N$28
  Top 0.406: R28.1 33.2,63.38 33.4,63.57
  Top 1.016: R27.2 33.4,63.57 33.4,62.05 37.85,57.6 C19.2
N$29
  Top 0.406: R28.2 23.69,63.38 23.62,63.31 | 23.62,63.31 D5.A 23.63,60.45 24.64,60.45 26.42,58.68 C19.1 | 23.62,63.31 ZD2.C
N$31
  Top 0.406: X4.5 31.68,70.87 28.44,67.63 26.48,67.63 | ZD2.A 26.53,67.58 26.48,67.63 | OK1.2 13.46,59.69 17.27,63.5 C20.2 18.8,64.77 21.65,67.63 26.48,67.63
N$32
  Top 0.254: X6.4 19.81,68.45 13.27,68.45 Q6.3
N$33
  Top 0.406: OK1.1 15.81,55.18 R26.2
N$34
  Top 0.406: R26.1 17.91,55.25 17.91,56.64 18.86,57.6 | D5.C 18.91,57.54 18.86,57.6 | 18.86,57.6 18.86,58.61 C20.1
N$37
  Top 0.254: X6.10 X6.8
  Bottom 0.254: 16.26,66.74 R33.2
  Bottom 0.406: R35.1 16.26,66.75 | 16.26,66.74 16.26,66.75 | 16.26,66.75 16.26,69.98 X6.8
N$38  (via drill 0.6)
  Top 0.254: X6.15 X6.16 X6.14 X6.12 11.24,70.42 12.45,71.63 12.45,73.03 13.34,73.92 v20.13,73.92
  Bottom 0.254: R31.2 22.16,68.45 21.91,68.71 21.08,68.71 20.13,69.66 v20.13,73.92
N$46
  Top 0.406: C8.2 R19.2
N$77
  Top 0.254: C17.2 R22.2
N$128
  Top 0.254: IC2.6 57.67,11.61 58.29,10.99 60.07,10.99 61.59,12.51 C17.1 62.17,12.77 63.82,14.42 63.82,14.86 R20.2 | R20.2 63.81,15.12 | R23.1 64.07,15.05 R20.2
N$131
  Top 0.356: C6.2 54.35,18.8 54.42,18.73 IC2.16
N$135  (1 unrouted)
  Top 0.254: IC2.5 57.04,11.48 58.04,10.48 62.1,10.48 R22.1
N$165
  Top 0.254: IC2.7 58.33,11.71 58.55,11.5 59.37,11.5 59.88,12 59.88,14.99 61.02,16.13 61.02,17.85 61.34,18.16 61.91,18.16 63.06,19.31 R21.1
N$166  (1 unrouted)
  Top 0.356: IC2.1 54.24,12.59 54.23,12.57
  Top 0.406: 54.23,12.57 52.96,12.57
N$167
  Top 0.254: IC2.8 58.99,13.08 59.12,13.08 59.31,13.27 59.31,15.18 60.45,16.32 60.45,19.18 C14.2
  Top 0.305: 61.09,19.56 61.66,19.56 C14.2
N$168
  Top 0.254: IC2.10 58.33,19.09 58.61,19.37 58.61,22.35 C9.1
N$180
  Top 0.254: R16.2 R15.1 52.26,10.73 53.98,10.73 55.08,11.84 IC2.2
N$223
  Top 0.254: R17.1 24.32,45.28 25.27,46.23 IC1.2 28.32,46.23 R18.1
N$227  (via drill 0.6)
  Top 0.254: v27.56,47.5 IC1.3 | v27.56,34.23 27.56,28.07 R14.1
  Bottom 0.254: v27.56,34.23 v27.56,47.5
NTC  (via drill 0.6)
  Top 0.254: MCU.A5 11.87,50.48 C2.2 10.19,48.67 R10.1 8.44,48.39 6.86,46.8 v6.86,45.47
  Bottom 0.254: v6.86,45.47 6.86,28.96 5.65,27.75 3.81,27.75 X3.13
OUT+
  Top 1.27: K_LOAD.S 48.77,31.43 39.81,40.39 5.08,40.39
  pour Top (isolate 0.305, no thermals): 2.22,42.42 6.35,42.42 6.99,41.78 8.26,41.78 8.26,40.83 6.99,40.83 5.71,39.56 5.71,36.7 4.45,36.7 4.45,37.02 2.86,38.61 2.22,38.61 1.91,38.93 1.91,42.1
OUT-
  Top 1.27: R7.1 5.08,32.39
  pour Top (isolate 0.305, no thermals): 2.54,36.7 3.17,36.7 3.17,36.39 4.76,34.8 5.4,34.8 5.71,34.48 5.71,31.31 5.4,30.99 5.08,30.67 2.54,30.67 1.91,31.31 1.91,36.7
OUT_MON
  Top 0.254: JP1.2 17.21,46.8 16.76,47.25 16.76,49.53 MCU.A4
SCLK
  Top 0.254: MCU.ICSP_MISO 11.18,27.05 9.34,27.05 6.92,24.64 6.92,23.62 6.03,22.73 3.87,22.73 X3.9
SW1
  Top 0.254: IC2.14 55.74,20.97
  Top 0.356: IC2.15 55.08,20.09
  pour Top (isolate 0.305, no thermals): 55.75,18.23 55.75,24.13 55.12,24.77 51.56,24.77 50.86,25.47 50.86,26.8 42.8,26.8 42.35,26.35 42.35,20.51 42.74,20.13 54.04,20.13 54.99,19.18 54.99,18.23
TA3  (via drill 3.2 pad 6)
  other vias: 80,72

### Text on the board
Bottom: EEZ PSU tester | 12/2016 r1B2
tPlace: + | DC in | Max. 55V | EEZ PSU tester | (12/2016 r1B2)
bPlace: Earth AC output | AUX AC in | AC input Earth | + - Earth | + - Earth
_tNames: X4 | X5 | X6 | C20 | R28 | Q6 | ZD2 | R27 | D4 | D5 | R30 | Q4 | K1 | OK1 | Q5 | C19 | R26 | R24 | R25 | Q3 | D2 | R29 | R10 | R9 | R18 | JP1 | K_LOAD | C2 | R1 | C1 | IC1 | C18 | R17 | R3 | R4 | D1 | R7 | K_DC | LED3 | R11 | X2 | R8 | C8 | R19 | C4 | R14 | L2 | Q2 | D3 | C9 | C3 | R13 | C10 | C14 | LED2 | LED1 | C6 | R12 | R21 | R23 | R6 | R5 | SW1 | SW2 | C11 | SP1 | R20 | C15 | R2 | C17 | C7 | IC2 | R22 | C12 | C13 | R16 | R15 | L1 | X1 | C16 | Q1 | C5
_bNames: R35 | R32 | R33 | R31 | R34